# Altium schematic sheet sink_iref_gen.SchDoc
size 177 x 63 mm; SheetNumber: 10; SheetTotal: 13
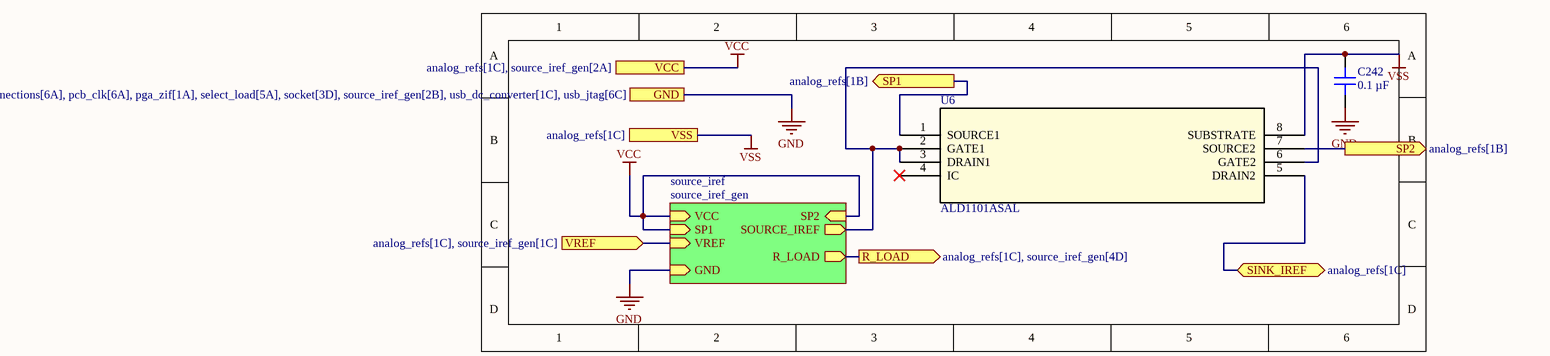
[diagram p0: sink_iref_gen.SchDoc]

## Parts
C242  0.1 µF  [CAP 0805_2012]
U6  ALD1101ASAL  [8-SOIC_ALD]

## Sub-sheets
source_iref = source_iref_gen: R_LOAD (out), VREF (in), SOURCE_IREF (out), VCC (in), GND (in), SP1 (in), SP2 (in)

## Ports
GND (see analog_refs[1C], analog_refs[3B], digital_socket[6A], fmc_connections[6A], pcb_clk[6A], pga_zif[1A], select_load[5A], socket[3D], source_iref_gen[2B], usb_dc_converter[1C], usb_jtag[6C]), R_LOAD (out, see analog_refs[1C], source_iref_gen[4D]), SINK_IREF (bidir, see analog_refs[1C]), SP1 (out, see analog_refs[1B]), SP2 (out, see analog_refs[1B]), VCC (see analog_refs[1C], source_iref_gen[2A]), VREF (in, see analog_refs[1C], source_iref_gen[1C]), VSS (see analog_refs[1C])

## Nets
GND: C242.1 ; port GND, sheet source_iref/GND
VCC: port VCC, sheet source_iref/VCC, sheet source_iref/SP1, sheet source_iref/SP2
VSS: C242.2 U6.8(SUBSTRATE) ; port VSS
R_LOAD: port R_LOAD, sheet source_iref/R_LOAD
SINK_IREF: U6.5(DRAIN2) ; port SINK_IREF
SP1: U6.1(SOURCE1) ; port SP1
SP2: U6.7(SOURCE2) ; port SP2
VREF: port VREF, sheet source_iref/VREF
NetU6_2: U6.2(GATE1) U6.3(DRAIN1) U6.6(GATE2) ; sheet source_iref/SOURCE_IREF

Not connected (* = marked no-connect by the designer): U6 4(IC)*

## Library data of the parts
C242 = 160R15W104KV4T: CAP CER 0.1UF 16V X7R 0805; manufacturer: Johanson Dielectrics Inc.; Tolerance: ±10%; Part Number: 160R15W104KV4T; Capacitance: 0.1 µF; Applications: General Purpose; componentlink1description: Datasheet; componentlink1url: https://www.johansondielectrics.com/downloads/catalog/johanson-dielectrics-product-catalog.pdf; componentlink2description: DigiKey Link; componentlink2url: https://www.digikey.com/en/products/detail/johanson-dielectrics-inc/160R15W104KV4T/1859428; Device Package: 0805 (2012 Metric); lastupdated: 4/6/2026 7:32:57 PM; Lifecycle Status: Active; Minimum Order: 1; Mounting Type: Surface Mount, MLCC; Operating Temperature: -55°C ~ 125°C; Package / Case: 0805 (2012 Metric); packaging: TapeAndReel; partid: 9125; Part Status: Active; price: 0.03; series: -; Size / Dimension: 0.080" L x 0.050" W (2.03mm x 1.27mm); Supplier 1: DigiKey; Supplier Part Number 1: 709-1183-1-ND; Temperature Coefficient: X7R; Thickness (Max): 0.050" (1.27mm); value: 0.1 µF; Voltage - Rated: 16V
U6 = ALD1101ASAL: No Description Available; Manufacturer_Name: Advanced Linear Devices; Copyright: Copyright (C) 2026 Ultra Librarian. All rights reserved.; Manufacturer_Part_Number: ALD1101ASAL; RefDes: RefDes; Type: Type